# EasyEDA schematic SCH_Espejo Pcb tof_2023-06-20.json
TITLE: Sheet_1; REV: 1.0; Date: 2023-05-25; Sheet: 1/1; Drawn By: omglocura; Company: Your Company
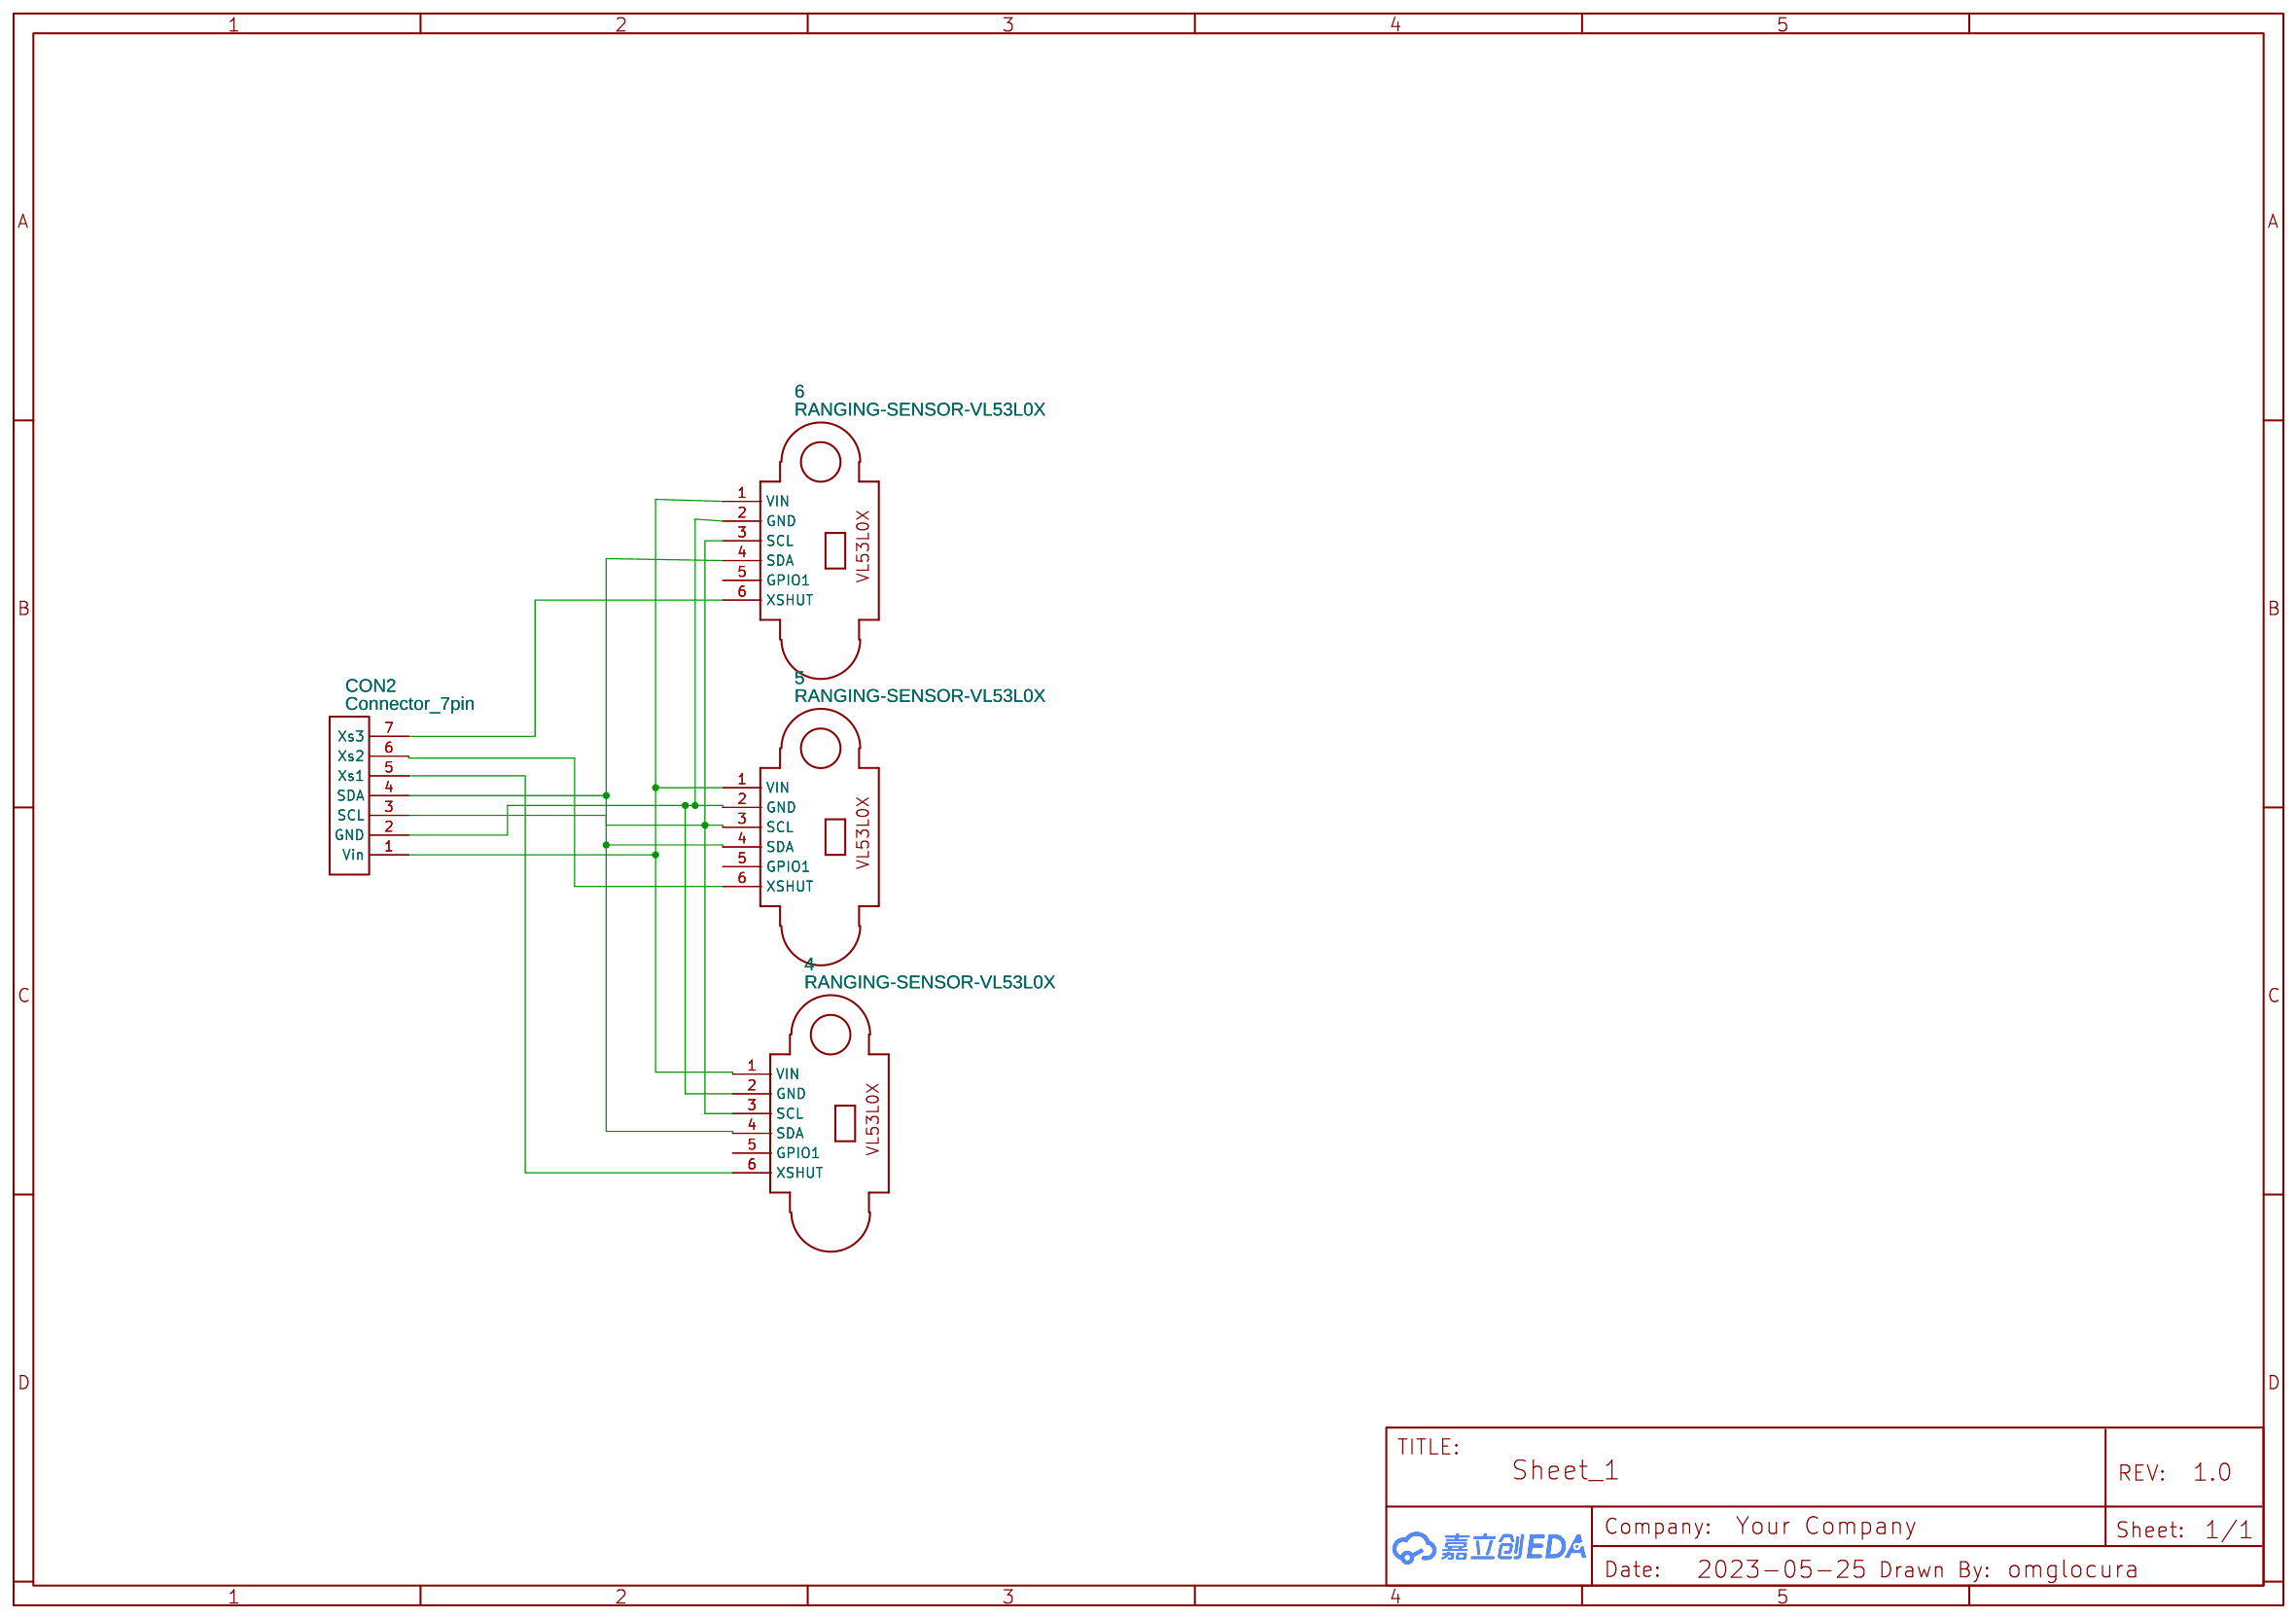
[diagram p0: schematic sheet]

## Parts
4  RANGING-SENSOR-VL53L0X  [RANGING-SENSOR-VL53L0X]
5  RANGING-SENSOR-VL53L0X  [RANGING-SENSOR-VL53L0X]
6  RANGING-SENSOR-VL53L0X  [RANGING-SENSOR-VL53L0X]
CON2  Connector_7pin  [CONNECTOR_7PIN]

## Library data of the parts
4-6 = RANGING-SENSOR-VL53L0X: Contributor: moung
CON2 = Connector_7pin: Contributor: panos

## Nets
Net-(4-1): 4.1(VIN) 5.1(VIN) 6.1(VIN) CON2.1(Vin)
Net-(4-2): 4.2(GND) 5.2(GND) 6.2(GND) CON2.2(GND)
Net-(4-3): 4.3(SCL) 5.3(SCL) 6.3(SCL) CON2.3(SCL)
Net-(4-4): 4.4(SDA) 5.4(SDA) 6.4(SDA) CON2.4(SDA)
Net-(4-6): 4.6(XSHUT) CON2.5(Xs1)
Net-(5-6): 5.6(XSHUT) CON2.6(Xs2)
Net-(6-6): 6.6(XSHUT) CON2.7(Xs3)

Not connected (* = marked no-connect by the designer): 4 5(GPIO1); 5 5(GPIO1); 6 5(GPIO1)
